# EasyEDA Pro project 4082驱动II.eprj

# Schematic 双机2.0
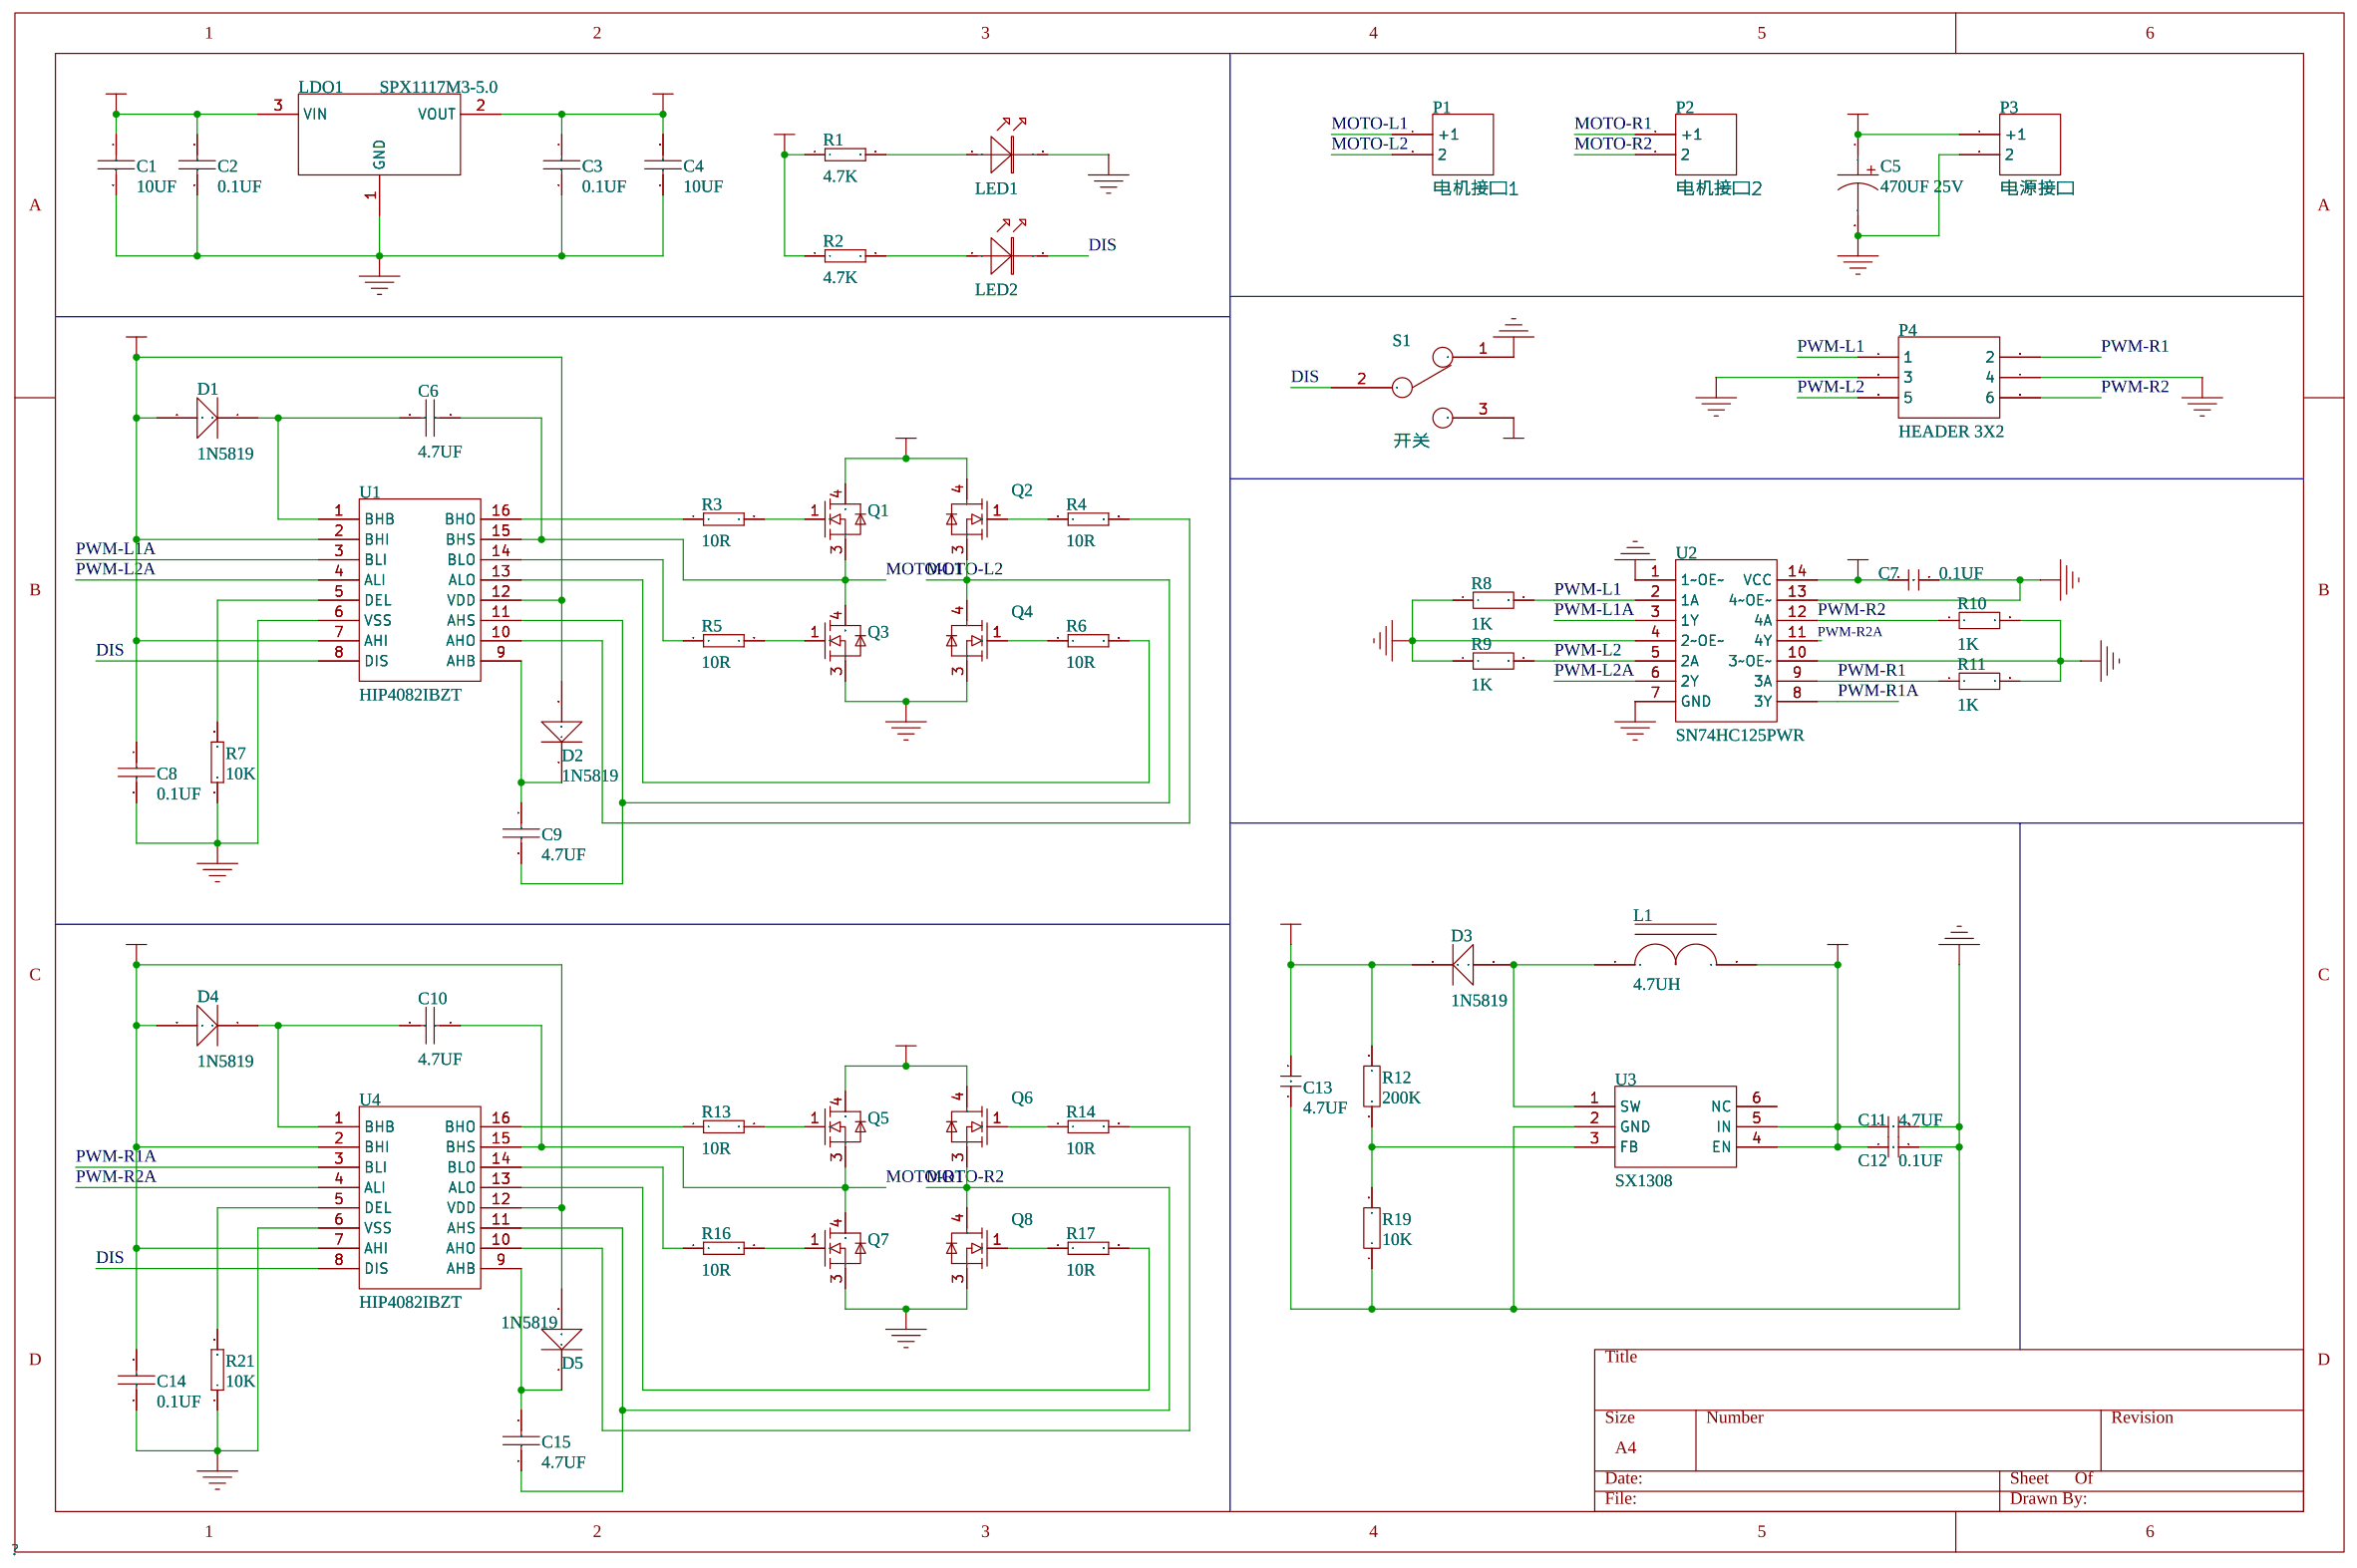
[diagram p0: schematic sheet]

## Parts
C1  10UF  [C 0603_L]
C2  0.1UF  [C 0603_L]
C3  0.1UF  [C 0603_L]
C4  10UF  [C 0603_L]
C5  470UF 25V  [CAP-TH_BD10.0-F5.00-D0.6-FD]
C6  4.7UF  [C 0603_L]
C7  0.1UF  [C 0603_L]
C8  0.1UF  [C 0603_L]
C9  4.7UF  [C 0603_L]
C10  4.7UF  [C 0603_L]
C11  4.7UF  [C 0603_L]
C12  0.1UF  [C 0603_L]
C13  4.7UF  [C 0603_L]
C14  0.1UF  [C 0603_L]
C15  4.7UF  [C 0603_L]
D1  1N5819  [SOD-123_L2.8-W1.8-LS3.7-RD]
D2  1N5819  [SOD-123_L2.8-W1.8-LS3.7-RD]
D3  1N5819  [SOD-123_L2.8-W1.8-LS3.7-RD]
D4  1N5819  [SOD-123_L2.8-W1.8-LS3.7-RD]
D5  1N5819  [SOD-123_L2.8-W1.8-LS3.7-RD]
L1  4.7UH  [CDRH74]
LDO1  SPX1117M3-5.0  [PCBComponent_1]
LED1  LED1  [LED0603-R-RD]
LED2  LED2  [LED0603-R-RD]
P1  电机接口1  [CONN-TH_XT30UPB-F]
P2  电机接口2  [CONN-TH_XT30UPB-F]
P3  电源接口  [CONN-TH_XT30UPB-F]
P4  HEADER 3X2  [HDR-TH_6P-P2.54-V-M-R2-C3-S2.54]
Q1  TPH1R403NL  [TO-252-2_L6.5-W6.1-P4.58-LS10.0-BR]
Q2  TPH1R403NL  [TO-252-2_L6.5-W6.1-P4.58-LS10.0-BR]
Q3  TPH1R403NL  [TO-252-2_L6.5-W6.1-P4.58-LS10.0-BR]
Q4  TPH1R403NL  [TO-252-2_L6.5-W6.1-P4.58-LS10.0-BR]
Q5  TPH1R403NL  [TO-252-2_L6.5-W6.1-P4.58-LS10.0-BR]
Q6  TPH1R403NL  [TO-252-2_L6.5-W6.1-P4.58-LS10.0-BR]
Q7  TPH1R403NL  [TO-252-2_L6.5-W6.1-P4.58-LS10.0-BR]
Q8  TPH1R403NL  [TO-252-2_L6.5-W6.1-P4.58-LS10.0-BR]
R1  4.7K  [R 0603_L]
R2  4.7K  [R 0603_L]
R3  10R  [R 0603_L]
R4  10R  [R 0603_L]
R5  10R  [R 0603_L]
R6  10R  [R 0603_L]
R7  10K  [R 0603_L]
R8  1K  [R 0603_L]
R9  1K  [R 0603_L]
R10  1K  [R 0603_L]
R11  1K  [R 0603_L]
R12  200K  [R 0603_L]
R13  10R  [R 0603_L]
R14  10R  [R 0603_L]
R16  10R  [R 0603_L]
R17  10R  [R 0603_L]
R19  10K  [R 0603_L]
R21  10K  [R 0603_L]
S1  开关  [SW-TH_SHOU-HAN_SS12D10G4]
U1  HIP4082IBZT  [SOIC-16_L9.9-W3.9-P1.27-LS6.0-BL]
U2  SN74HC125PWR  [TSSOP-14_L5.0-W4.4-P0.65-LS6.5-BL]
U3  SX1308  [SOT-23-6_L2.9-W1.6-P0.95-LS2.8-BR]
U4  HIP4082IBZT  [SOIC-16_L9.9-W3.9-P1.27-LS6.0-BL]

## Library data of the parts
C1 C4 = 10UF: Capacitor; Design Item ID: CAP; Library Name: ----20200314
C2 C3 C8 C14 = 0.1UF: Capacitor; Design Item ID: CAP; Library Name: ----20200314
C5 = 470UF 25V: Capacitor; Design Item ID: CAPACITOR POL; Library Name: ----20200314
C6 C9 C10 C15 = 4.7UF: Capacitor; Design Item ID: CAP; Library Name: ----20200314
C7 C12 = 0.1UF: -޼-----Ƭ----; BOM____: 无极性贴片电容; __Ȩ____: 源创客; ѧϰ__Դ: www.ooocke.com; ____: X7R; Design Item ID: C; Library Name: 3.1   - -------------
C11 C13 = 4.7UF: -޼-----Ƭ----; BOM____: 无极性贴片电容; __Ȩ____: 源创客; ѧϰ__Դ: www.ooocke.com; ____: X7R; Design Item ID: C; Library Name: 3.1   - -------------
D1 D2 D4 D5 = 1N5819: Library Name: Schlib3
D3 = 1N5819: Library Name: double qudong
L1 = 4.7UH: Design Item ID: INDUCTOR 2; Library Name: double qudong
LDO1 = SPX1117M3-5.0: Library Name: Schlib1
LED1 = LED1: Design Item ID: LED; Library Name: ----20200314
LED2 = LED2: Design Item ID: LED; Library Name: ----20200314
P1 = 电机接口1: Design Item ID: ----ӿ-; Library Name: Schlib1
P2 = 电机接口2: Design Item ID: ----ӿ-; Library Name: Schlib1
P3 = 电源接口: Design Item ID: ----ӿ-; Library Name: Schlib1
P4 = HEADER 3X2: Library Name: ----20200314
Q1 Q3 Q5 Q7 = TPH1R403NL: Design Item ID: TPH1R403NL_1; Library Name: DRV8701E
Q2 Q4 Q6 Q8 = TPH1R403NL: Library Name: DRV8701E
R1 R2 = 4.7K: Design Item ID: RES2; Library Name: ----20200314
R3-R6 R13 R14 R16 R17 = 10R: Design Item ID: RES2; Library Name: ----20200314
R7 R21 = 10K: Design Item ID: RES2; Library Name: ----20200314
R8-R11 = 1K: --Ƭ----; BOM____: 贴片电阻; ѧϰ__Դ: www.ooocke.com; __Ȩ____: 源创客; Design Item ID: R; Library Name: 3.1   - -------------
R12 = 200K: --Ƭ----; BOM____: 贴片电阻; ѧϰ__Դ: www.ooocke.com; __Ȩ____: 源创客; Design Item ID: R; Library Name: 3.1   - -------------
R19 = 10K: --Ƭ----; BOM____: 贴片电阻; ѧϰ__Դ: www.ooocke.com; __Ȩ____: 源创客; Design Item ID: R; Library Name: 3.1   - -------------
S1 = 开关: Design Item ID: ----; Library Name: DRV8701E
U1 U4 = HIP4082IBZT: Library Name: Schlib1
U2 = SN74HC125PWR: --̬-------·------ TSSOP-20; Library Name: -------ԭ--ͼ--
U3 = SX1308: sot-23-6С--ѹDC-DC; Library Name: -------ԭ--ͼ--

## Nets
5V: C3.1 C4.1 C7.1 C11.1 C12.1 L1.2 LDO1.2(VOUT) R1.1 R2.1 S1.3 U2.14(VCC) U3.4(EN) U3.5(IN)
12V: C8.1 C13.2 C14.1 D1.2 D2.2 D3.1 D4.2 D5.2 R12.2 U1.2(BHI) U1.7(AHI) U1.12(VDD) U4.2(BHI) U4.7(AHI) U4.12(VDD)
GND: C1.2 C2.2 C3.2 C4.2 C5.2 C7.2 C8.2 C11.2 C12.2 C13.1 C14.2 LDO1.1(GND) LED1.2 P3.2 P4.3 P4.4 Q3.3(S) Q4.3(S) Q7.3(S) Q8.3(S) R7.1 R8.1 R9.1 R10.2 R11.2 R19.1 R21.1 S1.1 U1.6(VSS) U2.1(1~OE~) U2.4(2~OE~) U2.7(GND) U2.10(3~OE~) U2.13(4~OE~) U3.2(GND) U4.6(VSS)
VCC: C1.1 C2.1 C5.1 LDO1.3(VIN) P3.1(+1) Q1.4(D) Q2.4(D) Q5.4(D) Q6.4(D)
DIS: LED2.2 S1.2 U1.8(DIS) U4.8(DIS)
MOTO-L1: C6.2 P1.1(+1) Q1.3(S) Q3.4(D) U1.15(BHS)
MOTO-L2: C9.2 P1.2 Q2.3(S) Q4.4(D) U1.11(AHS)
MOTO-R1: C10.2 P2.1(+1) Q5.3(S) Q7.4(D) U4.15(BHS)
MOTO-R2: C15.2 P2.2 Q6.3(S) Q8.4(D) U4.11(AHS)
PWM-L1: P4.1 R8.2 U2.2(1A)
PWM-L1A: U1.3(BLI) U2.3(1Y)
PWM-L2: P4.5 R9.2 U2.5(2A)
PWM-L2A: U1.4(ALI) U2.6(2Y)
PWM-R1: P4.2 R11.1 U2.9(3A)
PWM-R1A: U2.8(3Y) U4.3(BLI)
PWM-R2: P4.6 R10.1 U2.12(4A)
PWM-R2A: U2.11(4Y) U4.4(ALI)
NETC6_1: C6.1 D1.1 U1.1(BHB)
NETC9_1: C9.1 D2.1 U1.9(AHB)
NETC10_1: C10.1 D4.1 U4.1(BHB)
NETC15_1: C15.1 D5.1 U4.9(AHB)
NETD3_2: D3.2 L1.1 U3.1(SW)
NETLED1_1: LED1.1 R1.2
NETLED2_1: LED2.1 R2.2
NETQ1_1: Q1.1(G) R3.2
NETQ2_1: Q2.1(G) R4.1
NETQ3_1: Q3.1(G) R5.2
NETQ4_1: Q4.1(G) R6.1
NETQ5_1: Q5.1(G) R13.2
NETQ6_1: Q6.1(G) R14.1
NETQ7_1: Q7.1(G) R16.2
NETQ8_1: Q8.1(G) R17.1
NETR3_1: R3.1 U1.16(BHO)
NETR4_2: R4.2 U1.10(AHO)
NETR5_1: R5.1 U1.14(BLO)
NETR6_2: R6.2 U1.13(ALO)
NETR7_2: R7.2 U1.5(DEL)
NETR12_1: R12.1 R19.2 U3.3(FB)
NETR13_1: R13.1 U4.16(BHO)
NETR14_2: R14.2 U4.10(AHO)
NETR16_1: R16.1 U4.14(BLO)
NETR17_2: R17.2 U4.13(ALO)
NETR21_2: R21.2 U4.5(DEL)

Not connected (* = marked no-connect by the designer): U3 6(NC)

# Board 双机3.0
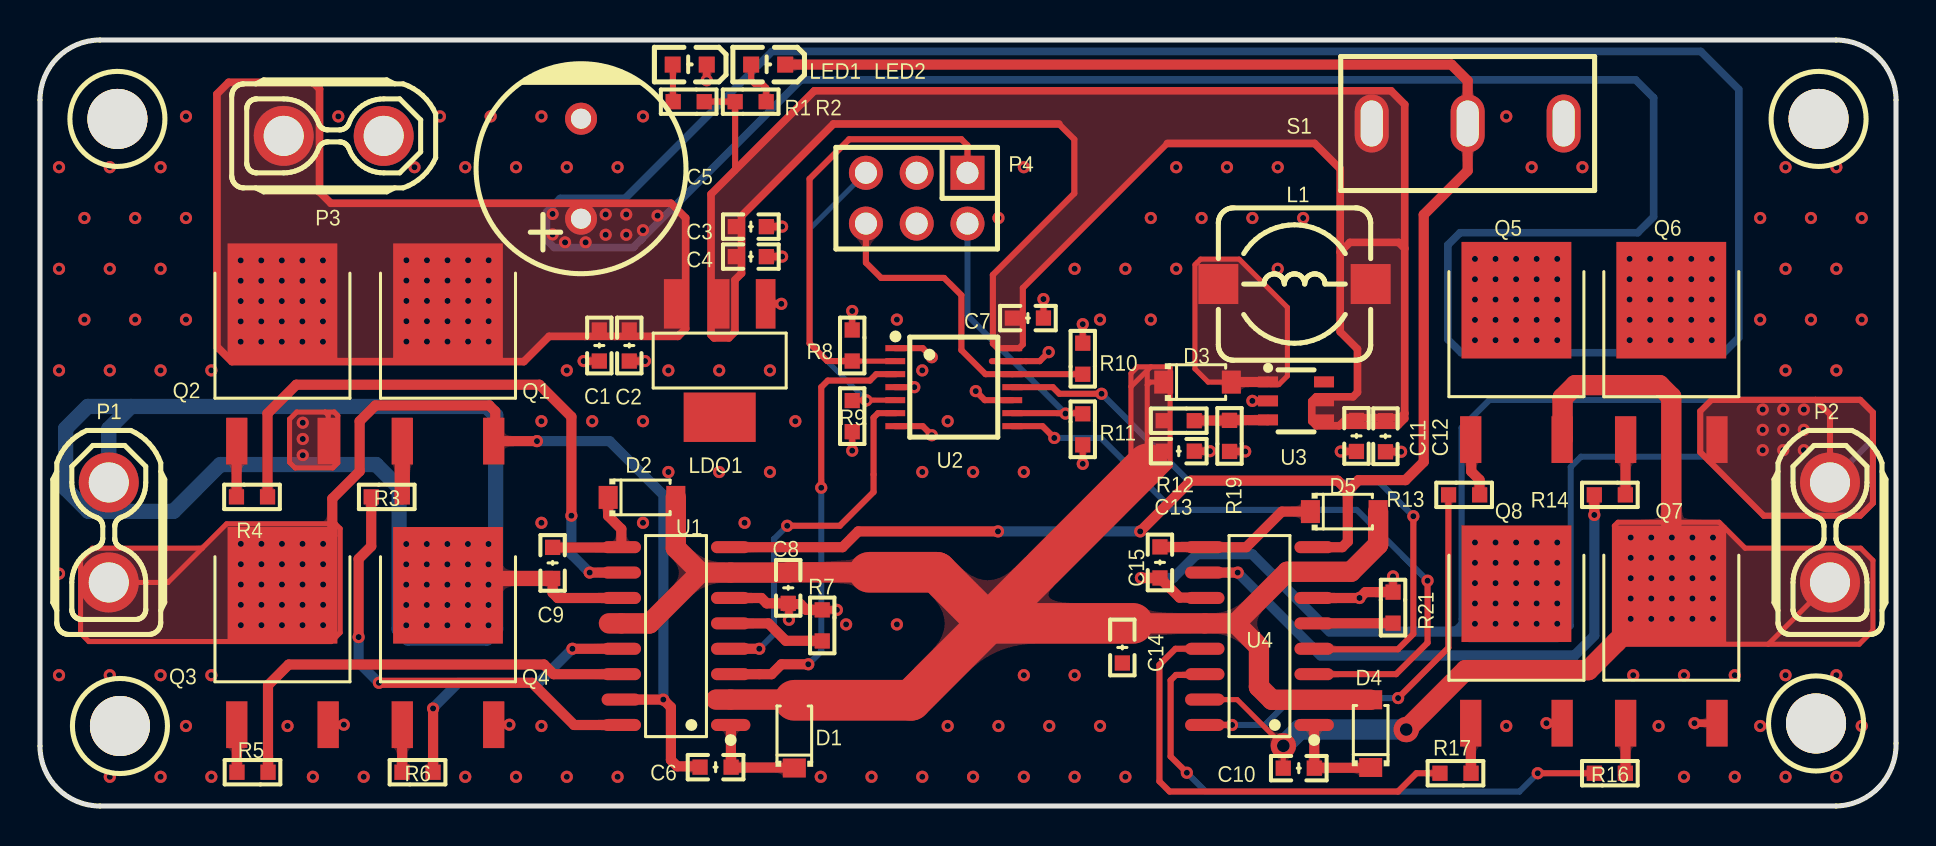
[diagram p1: board, top side]
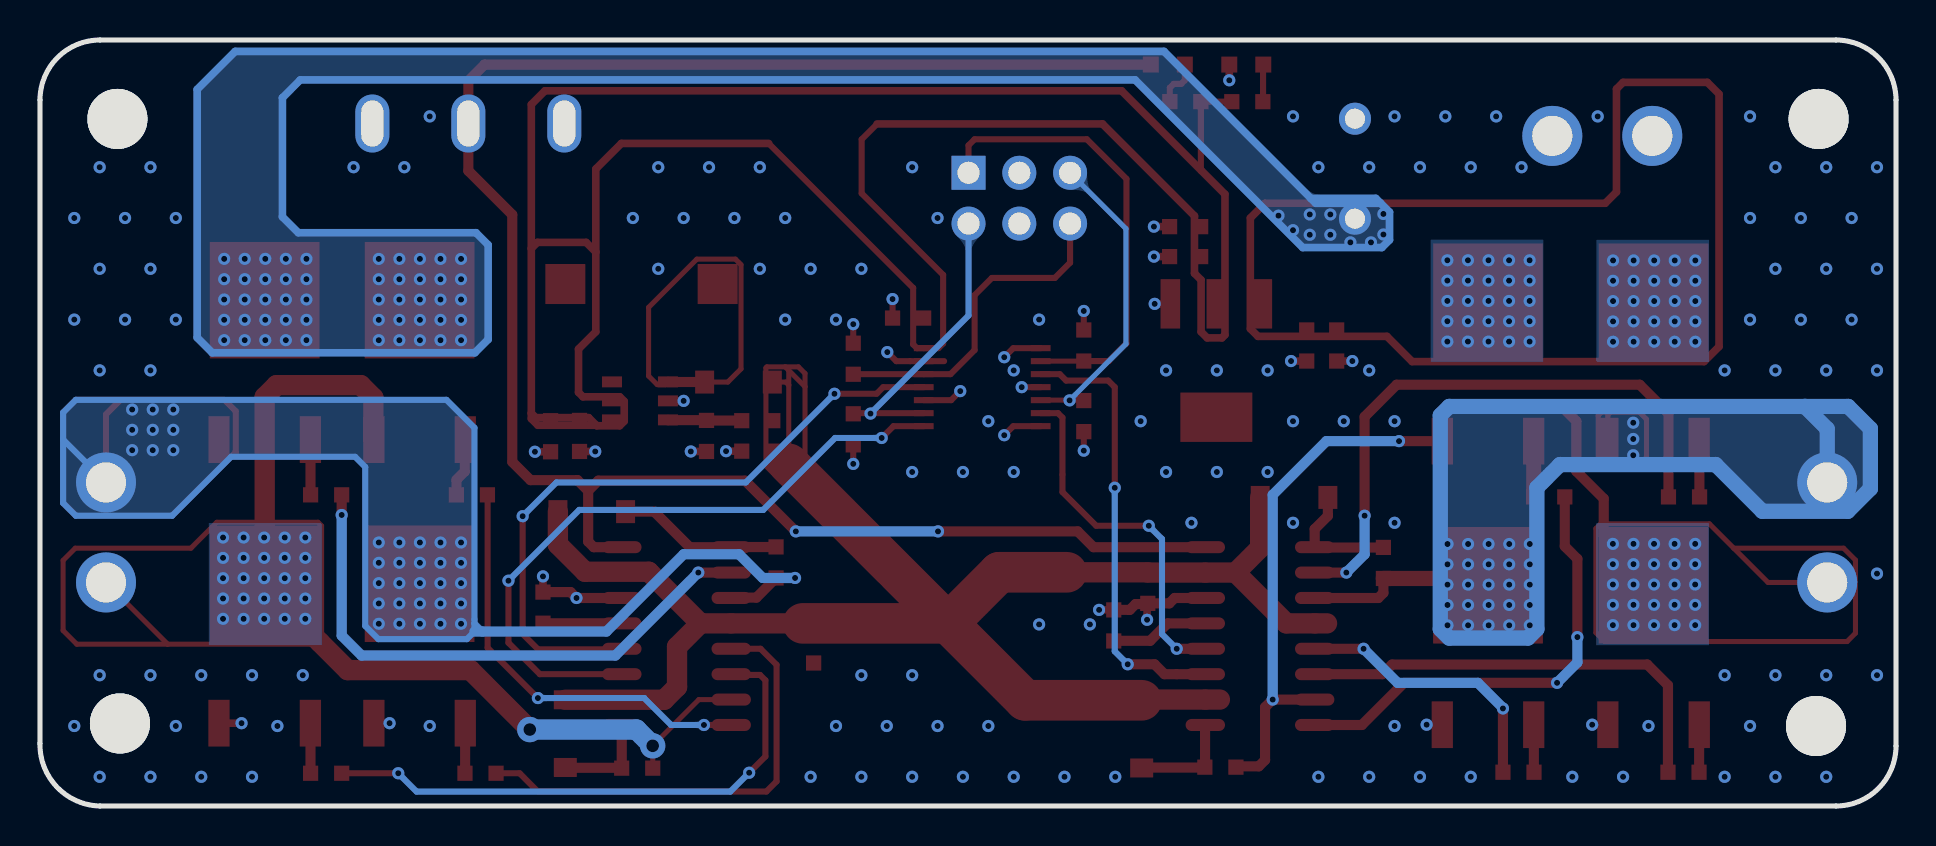
[diagram p2: board, bottom side, seen from below]

Outline 92.84 x 38.3 mm; copper layers: Top Layer, Bottom Layer. Coordinates in mm from the lower left corner of the outline.
Outline path: 0,35.3 0,3 arc(0.88,0.88) 3,0 89.84,0 arc(91.98,0.94) 92.84,3.13 92.84,35.3 arc(91.96,37.42) 89.84,38.3 3,38.3 arc(0.88,37.42) 0,35.3
Stack: Top Layer 0.0356mm / Dielectric 1 0.32mm FR-4 er 4.8 / Bottom Layer 0.0356mm

## Design rules (mm)
spacing Clearance (default): track to track 0.254, other pairs 0 to 0.381
track width PWR (default): min 0.254, default 0.508, max 2.032
track width Width: min 0.254, default 0.381, max 0.508
differential pair DiffPairsRouting (default): width min 0.381, default 0.381, max 0.381; gap min 0.254, default 0.254
via viaSize (default): diameter min 0.5, default 0.61, max 10; hole min 0.3, default 0.305, max 6

## Placement (name value [footprint] x y rotation side)
C1  10UF  [C 0603_L]  27.98 23.02 270 top
C2  0.1UF  [C 0603_L]  29.48 23.02 270 top
C3  0.1UF  [C 0603_L]  35.56 28.97 0 top
C4  10UF  [C 0603_L]  35.56 27.47 0 top
C5  470UF 25V  [CAP-TH_BD10.0-F5.00-D0.6-FD]  27.06 31.86 90 top
C6  4.7UF  [C 0603_L]  33.79 1.94 180 top
C7  0.1UF  [C 0603_L]  49.41 24.4 0 top
C8  0.1UF  [C 0603_L]  37.43 10.91 270 top
C9  4.7UF  [C 0603_L]  25.64 12.15 270 top
C10  4.7UF  [C 0603_L]  62.96 1.89 180 top
C11  4.7UF  [C 0603_L]  65.85 18.5 270 top
C12  0.1UF  [C 0603_L]  67.3 18.49 270 top
C13  4.7UF  [C 0603_L]  56.96 17.74 180 top
C14  0.1UF  [C 0603_L]  54.14 7.93 270 top
C15  4.7UF  [C 0603_L]  56.02 12.18 270 top
D1  1N5819  [SOD-123_L2.8-W1.8-LS3.7-RD]  37.73 3.59 90 top
D2  1N5819  [SOD-123_L2.8-W1.8-LS3.7-RD]  30.11 15.43 0 top
D3  1N5819  [SOD-123_L2.8-W1.8-LS3.7-RD]  57.9 21.2 0 top
D4  1N5819  [SOD-123_L2.8-W1.8-LS3.7-RD]  66.56 3.62 90 top
D5  1N5819  [SOD-123_L2.8-W1.8-LS3.7-RD]  65.24 14.72 0 top
L1  4.7UH  [CDRH74]  62.75 26.1 0 top
LDO1  SPX1117M3-5.0  [PCBComponent_1]  33.86 26.39 90 top
LED1  LED1  [LED0603-R-RD]  32.5 37.07 180 top
LED2  LED2  [LED0603-R-RD]  36.42 37.07 180 top
NOREF  -  [Pad_ie6]  88.96 34.35 180 top
NOREF#2  -  [Pad_ie5]  88.84 4.13 90 top
NOREF#3  -  [Pad_ie4]  4 4 0 top
NOREF#4  -  [Pad_ie3]  3.87 34.35 270 top
P1  电机接口1  [CONN-TH_XT30UPB-F]  3.44 13.68 90 top
P2  电机接口2  [CONN-TH_XT30UPB-F]  89.53 13.68 90 top
P3  电源接口  [CONN-TH_XT30UPB-F]  14.69 33.51 0 top
P4  HEADER 3X2  [HDR-TH_6P-P2.54-V-M-R2-C3-S2.54]  43.85 30.39 180 top
Q1  TPH1R403NL  [TO-252-2_L6.5-W6.1-P4.58-LS10.0-BR]  20.41 21.73 270 top
Q2  TPH1R403NL  [TO-252-2_L6.5-W6.1-P4.58-LS10.0-BR]  12.13 21.73 270 top
Q3  TPH1R403NL  [TO-252-2_L6.5-W6.1-P4.58-LS10.0-BR]  12.13 7.55 270 top
Q4  TPH1R403NL  [TO-252-2_L6.5-W6.1-P4.58-LS10.0-BR]  20.41 7.55 270 top
Q5  TPH1R403NL  [TO-252-2_L6.5-W6.1-P4.58-LS10.0-BR]  73.85 21.81 270 top
Q6  TPH1R403NL  [TO-252-2_L6.5-W6.1-P4.58-LS10.0-BR]  81.6 21.81 270 top
Q7  TPH1R403NL  [TO-252-2_L6.5-W6.1-P4.58-LS10.0-BR]  81.6 7.63 270 top
Q8  TPH1R403NL  [TO-252-2_L6.5-W6.1-P4.58-LS10.0-BR]  73.85 7.63 270 top
R1  4.7K  [R 0603_L]  32.45 35.22 180 top
R2  4.7K  [R 0603_L]  35.55 35.22 0 top
R3  10R  [R 0603_L]  17.35 15.46 0 top
R4  10R  [R 0603_L]  10.6 15.46 0 top
R5  10R  [R 0603_L]  10.63 1.69 180 top
R6  10R  [R 0603_L]  18.88 1.69 0 top
R7  10K  [R 0603_L]  39.13 9.03 270 top
R8  1K  [R 0603_L]  40.63 23.02 270 top
R9  1K  [R 0603_L]  40.63 19.49 90 top
R10  1K  [R 0603_L]  52.16 22.36 90 top
R11  1K  [R 0603_L]  52.16 18.83 270 top
R12  200K  [R 0603_L]  56.96 19.27 180 top
R13  10R  [R 0603_L]  71.23 15.56 0 top
R14  10R  [R 0603_L]  78.52 15.56 180 top
R16  10R  [R 0603_L]  78.52 1.64 0 top
R17  10R  [R 0603_L]  70.8 1.64 180 top
R19  10K  [R 0603_L]  59.5 18.5 90 top
R21  10K  [R 0603_L]  67.68 9.92 270 top
S1  开关  [SW-TH_SHOU-HAN_SS12D10G4]  71.41 34.12 180 top
U1  HIP4082IBZT  [SOIC-16_L9.9-W3.9-P1.27-LS6.0-BL]  31.81 8.5 90 top
U2  SN74HC125PWR  [TSSOP-14_L5.0-W4.4-P0.65-LS6.5-BL]  45.71 20.94 270 top
U3  SX1308  [SOT-23-6_L2.9-W1.6-P0.95-LS2.8-BR]  62.83 20.26 180 top
U4  HIP4082IBZT  [SOIC-16_L9.9-W3.9-P1.27-LS6.0-BL]  61 8.5 90 top

## Footprints (pads in the part's own frame, mm; a bottom-side part is the same pattern mirrored in y, then rotated)
C 0603_L
  rect 0.762x0.762 smd: 1(-0.777,0) 2(0.777,0)
CAP-TH_BD10.0-F5.00-D0.6-FD
  round 1.6 hole 1: 1(-2.5,0) 2(2.5,0)
CDRH74
  rect 2x2 smd: 1(-3.81,0) 2(3.81,0)
CONN-TH_XT30UPB-F
  round 3 hole 2: 1(-2.5,0) 2(2.5,0)
HDR-TH_6P-P2.54-V-M-R2-C3-S2.54
  rect 1.7x1.7 hole 1.1: 1(-2.54,-1.27)
  round 1.7 hole 1.1: 2(-2.54,1.27) 3(0,-1.27) 4(0,1.27) 5(2.54,-1.27) 6(2.54,1.27)
LED0603-R-RD
  rect 0.8x0.8 smd: 1(0.851,0) 2(-0.851,0)
Pad_ie3
  round 3 hole 3: 1(0,0)
Pad_ie4
  round 3 hole 3: 1(0,0)
Pad_ie5
  round 3 hole 3: 1(0,0)
Pad_ie6
  round 3 hole 3: 1(0,0)
PCBComponent_1
  rect 2.47x0.98 smd: 1(-1.286,-2.438) 2(-1.286,-0.138) 3(-1.286,2.163)
  rect 2.47x3.6 smd: 2(-6.955,-0.138)
R 0603_L
  rect 0.762x0.762 smd: 1(-0.777,0) 2(0.777,0)
SOD-123_L2.8-W1.8-LS3.7-RD
  rect 0.95x1.15 smd: 1(-1.692,0) 2(1.692,0)
SOIC-16_L9.9-W3.9-P1.27-LS6.0-BL
  oval 0.602x1.971 smd: 1(-4.445,-2.736) 2(-3.175,-2.736) 3(-1.905,-2.736) 4(-0.635,-2.736) 5(0.635,-2.736) 6(1.905,-2.736) 7(3.175,-2.736) 8(4.445,-2.736) 9(4.445,2.736) 10(3.175,2.736) 11(1.905,2.736) 12(0.635,2.736) 13(-0.635,2.736) 14(-1.905,2.736) 15(-3.175,2.736) 16(-4.445,2.736)
SOT-23-6_L2.9-W1.6-P0.95-LS2.8-BR
  rect 1x0.55 smd: 1(1.4,-0.95) 2(1.4,0) 3(1.4,0.95) 4(-1.4,0.95) 5(-1.4,0) 6(-1.4,-0.95)
SW-TH_SHOU-HAN_SS12D10G4
  oval 1.7x2.9 hole 1.1x2.3: 1(-4.8,0) 2(0,0) 3(4.8,0)
TO-252-2_L6.5-W6.1-P4.58-LS10.0-BR
  rect 2.336x1.064 smd: 1(3.486,-2.286) 3(3.486,2.286)
  rect 5.826x5.491 smd: 4(-3.486,0)
TSSOP-14_L5.0-W4.4-P0.65-LS6.5-BL
  rect 0.305x0.991 smd: 1(-1.95,-2.925) 2(-1.3,-2.925) 3(-0.65,-2.925) 4(0,-2.925) 5(0.65,-2.925) 6(1.3,-2.925) 7(1.95,-2.925) 8(1.95,2.925) 9(1.3,2.925) 10(0.65,2.925) 11(0,2.925) 12(-0.65,2.925) 13(-1.3,2.925) 14(-1.95,2.925)

## Nets
As in the schematic.

Pads without a net: NOREF 1; NOREF#2 1; NOREF#3 1; NOREF#4 1; U3 6

## Via types
v1: diameter 0.61, hole 0.305, Top Layer to Bottom Layer, 400 vias
v2: diameter 1.27, hole 0.635, Top Layer to Bottom Layer, 2 vias

## Routing (per net, layer and track width the routed paths; a pad name or vN(x,y) marks a point on that pad's centre or on a via; arc(x,y) is an arc through that point)
5V: length 153.7
  Top Layer w0.305: R1.1 R2.1 34.77,31.8 34.72,31.75 ; 56.39,33.13 49.16,25.9 49.16,23.08 48.97,22.89 U2.14 47.9,22.89 47.66,23.13 47.66,26.56 51.74,30.63 51.74,33.33 50.97,34.1
  Top Layer w0.381: 34.77,31.8 38.74,35.76 67.58,35.76 68.26,35.08 68.26,27.88 ; 65.04,27.7 65.04,31.85 63.76,33.13 56.39,33.13 ; 65.04,27.7 65.04,23.71 65.9,22.85 65.9,20.68 65.68,20.46 63.84,20.46 63.61,20.24 63.61,19.24 63.84,19.01 64.99,19.01 65.01,19.04 ; 65.04,27.7 65.52,28.18 67.96,28.18 68.26,27.88 ; 68.26,19.64 68.26,19.37 67.93,19.04 65.01,19.04 ; 68.26,19.64 68.26,27.88 ; 68.26,19.64 68.04,19.42 65.39,19.42 65.01,19.04 ; 34.72,31.75 33.57,30.59 33.57,23.56 33.72,23.41 34.45,23.41 34.76,23.71 34.76,26.3 35.09,26.63 35.09,29.5 39.69,34.1 50.97,34.1 ; C7.1 48.64,24.4
12V: length 103.9
  Top Layer w0.254: 54.57,17.11 54.57,20.97 ; 54.57,20.97 54.57,21.63 54.9,21.96 55.56,21.96 ; 54.57,20.97 55.38,21.78 ; 55.38,21.78 55.38,21.05 ; 55.38,21.78 55.56,21.96 ; D3.1 55.53,21.2 55.38,21.05 ; 55.56,21.96 56.48,21.96 56.53,21.91 56.53,17 55.74,16.22 ; 55.38,21.05 55.38,17.08 55.45,17.01 55.51,16.95
  Top Layer w0.508: 56.17,19.28 R12.2
  Top Layer w1.016: 33.03,11.67 37.43,11.67 ; 33.03,11.67 31.8,12.9 D2.2 ; 33.03,11.67 30.49,9.13 U1.12 28.46,9.13 ; C8.1 41.48,11.69 ; 59.8,9.13 60.97,7.96 60.97,5.96 61.62,5.31 D4.2 ; 59.8,9.13 62.38,11.71 65.57,11.71 66.93,13.07 D5.2 ; 59.8,9.13 U4.12 54.67,9.13 ; 37.73,5.32 U1.2 33.82,5.32 ; 49.96,11.69 50.18,11.9
  Top Layer w2.032: 41.48,11.69 44.85,11.69 47.41,9.13 ; 47.41,9.13 43.56,5.29 D1.2 ; 47.41,9.13 49.96,11.69 ; 47.41,9.13 54.67,9.13 ; 50.18,11.9 55.38,17.11
GND: length 38.1
  Top Layer w0.305: R10.2 v1(52.16,24.09) ; v1(44.61,22.44) 44.15,22.89 U2.1 ; U2.7 44.15,18.99 v1(44.61,18.54) ; C7.2 v1(50.19,25.35) ; R8.1 v1(40.63,24.75) ; v1(40.63,17.77) R9.1 ; U2.10 47.26,20.29 v1(46.81,20.74) ; v1(52.16,17.11) R11.2 ; U2.4 v1(43.73,20.94) ; 47.61,22.24 U2.13 50,22.24 v1(50.46,22.69)
  Top Layer w0.381: v1(37.46,9.31) 37.46,10.1 ; C4.2 v1(37.12,27.47) ; C12.2 v1(68.08,17.71) ; v1(75.35,4.14) Q8.3 ; v1(82.75,4.14) Q7.3 ; v1(60.64,20.26) U3.2 ; v1(33.35,36.29) 33.35,37.07 ; R19.1 v1(60.28,17.73) ; Q4.3 v1(23.48,4.06) ; v1(65.06,17.73) C11.2 ; C2.2 v1(30.26,22.25) ; 36.3,25.11 v1(37.08,25.11) ; 39.08,9.81 v1(39.86,9.81) ; R21.1 v1(67.68,11.48) ; Q3.3 v1(15.2,4.06) ; C13.1 v1(58.52,17.74) ; C3.2 v1(37.12,28.97) ; v1(27.19,22.25) C1.2
  Top Layer w0.508: R7.1 38.33,9.81 38.04,10.1 37.46,10.1 C8.2 36.35,10.13 36.08,10.4 U1.6 ; R21.1 66.3,10.69 v1(66,10.4) U4.6
  vias: v1(0.95,31.94) v1(0.95,26.86) v1(0.95,21.78) v1(0.95,11.62) v1(0.95,6.54) v1(2.22,29.4) v1(2.22,24.32) v1(3.49,31.94) v1(3.49,26.86) v1(3.49,21.78) v1(3.49,6.54) v1(3.49,1.46) v1(4.76,29.4) v1(4.76,24.32) v1(6.03,31.94) v1(6.03,26.86) v1(6.03,21.78) v1(6.03,6.54) v1(6.03,1.46) v1(7.3,34.48) v1(7.3,29.4) v1(7.3,24.32) v1(7.3,4) v1(8.57,21.78) v1(8.57,6.54) v1(8.57,1.46) v1(12.38,4) v1(13.65,1.46) v1(14.92,34.48) v1(16.19,1.46) v1(18.73,31.94) v1(20,34.48) v1(21.27,31.94) v1(21.27,1.46) v1(22.54,34.48) v1(23.81,31.94) v1(23.81,1.46) v1(25.08,34.48) v1(25.08,19.24) v1(25.08,14.16) v1(25.08,4) v1(26.35,31.94) v1(26.35,21.78) v1(26.35,1.46) v1(27.62,19.24) v1(28.89,31.94) v1(28.89,1.46) v1(30.16,34.48) v1(30.16,19.24) v1(30.16,14.16) v1(31.43,21.78) v1(31.43,16.7) v1(33.97,21.78) v1(33.97,16.7) v1(35.24,14.16) v1(36.51,21.78) v1(36.51,16.7) v1(37.78,19.24) v1(39.05,1.46) v1(40.32,9.08) v1(41.59,1.46) v1(42.86,24.32) v1(42.86,9.08) v1(44.13,21.78) v1(44.13,16.7) v1(44.13,1.46) v1(45.4,19.24) v1(45.4,4) v1(46.67,16.7) v1(46.67,1.46) v1(47.94,29.4) v1(47.94,4) v1(49.21,31.94) v1(49.21,16.7) v1(49.21,6.54) v1(49.21,1.46) v1(50.48,4) v1(51.75,26.86) v1(51.75,6.54) v1(51.75,1.46) v1(53.02,24.32) v1(53.02,4) v1(54.29,26.86) v1(54.29,1.46) v1(55.56,29.4) v1(55.56,24.32) v1(56.83,31.94) v1(56.83,26.86) v1(58.1,29.4) v1(59.37,31.94) v1(60.64,29.4) v1(61.91,31.94) v1(61.91,26.86) v1(63.18,29.4) v1(73.34,34.48) v1(73.34,4) v1(74.61,31.94) v1(77.15,31.94) v1(79.69,6.54) v1(80.96,4) v1(82.23,6.54) v1(82.23,1.46) v1(84.77,6.54) v1(84.77,1.46) v1(86.04,29.4) v1(86.04,24.32) v1(86.04,4) v1(87.31,31.94) v1(87.31,26.86) v1(87.31,21.78) v1(87.31,6.54) v1(87.31,1.46) v1(88.58,29.4) v1(88.58,24.32) v1(89.85,31.94) v1(89.85,26.86) v1(89.85,21.78) v1(89.85,6.54) v1(89.85,1.46) v1(91.12,29.4) v1(91.12,24.32) v1(91.12,4)
VCC: length 249.3
  Top Layer w0.381: 8.85,35.6 9.44,36.18 13.65,36.18 13.98,35.85 13.98,30.7 14.55,30.14 31.56,30.14 32.3,29.4 32.3,23.86 31.91,23.48 25.46,23.48 24.2,22.22 9.6,22.22 8.85,22.97 8.85,35.6
  Bottom Layer w0.381: 25.78,30.14 29.02,30.14 29.27,30.38 ; 25.78,30.14 26.02,30.38 29.27,30.38 ; 25.78,30.14 25.34,29.69 25.34,28.3 25.72,27.92 29.68,27.92 38.06,36.31 79.82,36.31 80.71,35.41 80.71,29.46 79.92,28.66 71.03,28.66 70.42,28.05 70.42,23.33 71.09,22.66 84.22,22.66 84.97,23.42 84.97,35.83 83.07,37.73 36.62,37.73 29.27,30.38
  vias: v1(10.04,27.28) v1(10.04,26.26) v1(10.04,25.25) v1(10.04,24.23) v1(10.04,23.21) v1(11.07,27.28) v1(11.07,26.26) v1(11.07,25.25) v1(11.07,24.23) v1(11.07,23.21) v1(12.1,27.28) v1(12.1,26.26) v1(12.1,25.25) v1(12.1,24.23) v1(12.1,23.21) v1(13.12,27.28) v1(13.12,26.26) v1(13.12,25.25) v1(13.12,24.23) v1(13.12,23.21) v1(14.15,27.28) v1(14.15,26.26) v1(14.15,25.25) v1(14.15,24.23) v1(14.15,23.21) v1(18.33,27.29) v1(18.33,26.27) v1(18.33,25.25) v1(18.33,24.24) v1(18.33,23.22) v1(19.36,27.29) v1(19.36,26.27) v1(19.36,25.25) v1(19.36,24.24) v1(19.36,23.22) v1(20.38,27.29) v1(20.38,26.27) v1(20.38,25.25) v1(20.38,24.24) v1(20.38,23.22) v1(21.41,27.29) v1(21.41,26.27) v1(21.41,25.25) v1(21.41,24.24) v1(21.41,23.22) v1(22.44,27.29) v1(22.44,26.27) v1(22.44,25.25) v1(22.44,24.24) v1(22.44,23.22) v1(25.64,29.6) v1(25.64,28.57) v1(26.26,28.18) v1(27.29,28.18) v1(28.29,29.58) v1(28.29,28.56) v1(29.32,29.58) v1(29.32,28.56) v1(30.16,28.79) v1(30.89,29.52) v1(71.78,27.35) v1(71.78,26.34) v1(71.78,25.32) v1(71.78,24.31) v1(71.78,23.29) v1(72.81,27.35) v1(72.81,26.34) v1(72.81,25.32) v1(72.81,24.31) v1(72.81,23.29) v1(73.83,27.35) v1(73.83,26.34) v1(73.83,25.32) v1(73.83,24.31) v1(73.83,23.29) v1(74.86,27.35) v1(74.86,26.34) v1(74.86,25.32) v1(74.86,24.31) v1(74.86,23.29) v1(75.89,27.35) v1(75.89,26.34) v1(75.89,25.32) v1(75.89,24.31) v1(75.89,23.29) v1(79.51,27.36) v1(79.51,26.34) v1(79.51,25.33) v1(79.51,24.31) v1(79.51,23.29) v1(80.54,27.36) v1(80.54,26.34) v1(80.54,25.33) v1(80.54,24.31) v1(80.54,23.29) v1(81.57,27.36) v1(81.57,26.34) v1(81.57,25.33) v1(81.57,24.31) v1(81.57,23.29) v1(82.6,27.36) v1(82.6,26.34) v1(82.6,25.33) v1(82.6,24.31) v1(82.6,23.29) v1(83.62,27.36) v1(83.62,26.34) v1(83.62,25.33) v1(83.62,24.31) v1(83.62,23.29)
DIS: length 95.6
  Top Layer w0.508: v1(55.03,13.73) 57.57,16.27 64.91,16.27 65.42,15.76 ; 65.42,15.76 65.95,16.29 68.3,16.29 69.21,17.21 69.21,29.56 71.41,31.76 S1.2 71.41,36.26 70.6,37.07 LED2.2 ; 65.42,15.76 65.42,13.22 65.14,12.94 U4.8 ; U1.8 40.14,12.94 40.93,13.73 v1(47.92,13.73)
  Bottom Layer w0.508: v1(47.92,13.73) v1(55.03,13.73)
MOTO-L1: length 86.7
  Top Layer w0.254: 8.11,12.89 9.33,14.11 14.77,14.11 15.01,13.87 15.01,8.67 14.57,8.22 2.45,8.22 2.03,8.64 2.03,12.3 2.62,12.89 8.11,12.89 ; 8.11,12.89 6.4,11.18 P1.1
  Top Layer w0.508: v1(24.86,18.24) Q1.3 22.77,18.32 22.77,19.73 22.47,20.03 16.78,20.03 15.99,19.24 15.99,16.74 14.62,15.37 14.62,13.53 14.18,13.09 13.16,12.07 Q3.4 ; U1.15 v1(31.18,5.32) 31.56,4.94 31.56,2.3 31.87,1.98 32.98,1.98 33.02,1.94
  Bottom Layer w0.508: v1(31.18,5.32) 31.18,15.56 28.49,18.24 v1(24.86,18.24)
  vias: v1(10.05,13.11) v1(10.05,12.09) v1(10.05,11.08) v1(10.05,10.06) v1(10.05,9.04) v1(11.08,13.11) v1(11.08,12.09) v1(11.08,11.08) v1(11.08,10.06) v1(11.08,9.04) v1(12.1,13.11) v1(12.1,12.09) v1(12.1,11.08) v1(12.1,10.06) v1(12.1,9.04) v1(13.13,13.11) v1(13.13,12.09) v1(13.13,11.08) v1(13.13,10.06) v1(13.13,9.04) v1(14.16,13.11) v1(14.16,12.09) v1(14.16,11.08) v1(14.16,10.06) v1(14.16,9.04)
MOTO-L2: length 92.2
  Top Layer w0.254: 14.27,19.7 14.41,19.55 Q2.3 ; 14.27,19.7 12.84,19.7 12.48,19.34 12.48,17.18 12.76,16.9 14.64,16.9 14.9,17.16 14.9,19.52 14.72,19.7 14.27,19.7
  Top Layer w0.508: C9.2 25.64,10.66 25.9,10.4 U1.11
  Top Layer w0.762: 14.49,18.32 Q2.3 14.31,18.35 ; C9.2 20.75,11.38 Q4.4
  Bottom Layer w0.762: 4.56,19.98 3.44,18.86 P1.2 ; 4.56,19.98 22.35,19.98 22.79,19.53 22.79,8.84 22.35,8.4 18.41,8.4 17.97,8.84 17.97,15.92 16.81,17.07 9.02,17.07 6.68,14.74 2.41,14.74 1.28,15.87 1.28,18.87 2.39,19.98 4.56,19.98
  vias: v1(13.14,19.16) v1(13.14,18.35) v1(13.14,17.54) v1(18.32,13.1) v1(18.32,12.08) v1(18.32,11.07) v1(18.32,10.05) v1(18.32,9.04) v1(19.35,13.1) v1(19.35,12.08) v1(19.35,11.07) v1(19.35,10.05) v1(19.35,9.04) v1(20.38,13.1) v1(20.38,12.08) v1(20.38,11.07) v1(20.38,10.05) v1(20.38,9.04) v1(21.41,13.1) v1(21.41,12.08) v1(21.41,11.07) v1(21.41,10.05) v1(21.41,9.04) v1(22.43,13.1) v1(22.43,12.08) v1(22.43,11.07) v1(22.43,10.05) v1(22.43,9.04)
MOTO-R1: length 86.9
  Top Layer w0.254: 86.45,8.09 78.93,8.09 78.84,8.18 78.75,8.27 78.75,14.01 78.93,14.19 83.99,14.19 85.29,12.89 91.07,12.89 91.68,12.28 91.68,8.78 91,8.09 86.45,8.09 ; 86.45,8.09 P2.1 ; U4.15 59.88,5.32 62.19,3.01 C10.2
  Top Layer w1.016: v2(68.34,3.82) 71.31,6.79 77.45,6.79 81.6,10.94 Q7.4 81.6,20.45 81,21.04 76.8,21.04 76.16,20.41 76.16,18.34 Q5.3
  Bottom Layer w1.016: v2(68.34,3.82) 63,3.82 v2(62.19,3.01)
  vias: v1(79.57,13.42) v1(79.57,12.41) v1(79.57,11.39) v1(79.57,10.38) v1(79.57,9.36) v1(80.59,13.42) v1(80.59,12.41) v1(80.59,11.39) v1(80.59,10.38) v1(80.59,9.36) v1(81.62,13.42) v1(81.62,12.41) v1(81.62,11.39) v1(81.62,10.38) v1(81.62,9.36) v1(82.65,13.42) v1(82.65,12.41) v1(82.65,11.39) v1(82.65,10.38) v1(82.65,9.36) v1(83.68,13.42) v1(83.68,12.41) v1(83.68,11.39) v1(83.68,10.38) v1(83.68,9.36)
MOTO-R2: length 122.5
  Top Layer w0.305: 88.81,20.31 83.61,20.31 83.04,19.74 83.04,17.69 86.22,14.52 91.05,14.52 91.68,15.15 91.68,19.67 91.05,20.31 88.81,20.31 ; 88.81,20.31 89.53,19.58 P2.2
  Top Layer w0.508: U4.11 58.24,10.42 57,10.42 C15.2 v1(55.07,11.4)
  Bottom Layer w0.305: 91.68,18.32 91.68,19.67 91.05,20.31 72.5,20.31 71.11,18.91 71.11,9.13 ; 91.68,18.32 91.68,15.15 91.05,14.52 86.22,14.52 83.28,17.46 77.08,17.46 76.57,16.95 76.57,9 75.91,8.34 71.49,8.34 71.11,8.72 71.11,9.13 ; 91.68,18.32 P2.2 ; 71.11,9.13 70.7,8.72
  Bottom Layer w0.508: 71.11,8.72 64.5,8.72 60.64,12.59 57.87,12.59 56.68,11.4 v1(55.07,11.4)
  vias: v1(71.78,13.18) v1(71.78,12.16) v1(71.78,11.14) v1(71.78,10.13) v1(71.78,9.11) v1(72.81,13.18) v1(72.81,12.16) v1(72.81,11.14) v1(72.81,10.13) v1(72.81,9.11) v1(73.83,13.18) v1(73.83,12.16) v1(73.83,11.14) v1(73.83,10.13) v1(73.83,9.11) v1(74.86,13.18) v1(74.86,12.16) v1(74.86,11.14) v1(74.86,10.13) v1(74.86,9.11) v1(75.89,13.18) v1(75.89,12.16) v1(75.89,11.14) v1(75.89,10.13) v1(75.89,9.11) v1(86.17,19.82) v1(86.17,18.81) v1(86.17,17.79) v1(87.2,19.82) v1(87.2,18.81) v1(87.2,17.79) v1(88.23,19.82) v1(88.23,18.81) v1(88.23,17.79)
NETC6_1: length 5.3
  Top Layer w0.508: 34.55,4.05 34.56,4.04 34.56,1.95 C6.1 34.59,1.92 37.71,1.92 37.73,1.9
NETC9_1: length 6.2
  Top Layer w0.508: 28.43,15.42 D2.1 28.42,14.51 29.08,13.85 U1.9 29.06,12.92 25.65,12.92 C9.1
NETC10_1: length 5
  Top Layer w0.508: 63.73,4.05 63.74,4.05 63.74,1.9 C10.1 63.76,1.91 66.54,1.91 D4.1
NETC15_1: length 8.3
  Top Layer w0.508: 63.56,14.71 D5.1 62.12,14.72 60.34,12.94 U4.9 58.25,12.95 56.03,12.95 C15.1 56.01,12.96
NETD3_2: length 19.5
  Top Layer w0.254: U3.1 61.56,21.07 61.96,21.07 62.39,21.5 62.39,24.93 59.98,27.34 58.05,27.34 57.87,27.17 57.77,27.06 57.77,21.86 58.43,21.2 D3.2
  Top Layer w0.508: U3.1 61.42,21.2 59.6,21.2 D3.2
NETLED1_1: length 1.9
  Top Layer w0.305: LED1.1 31.66,37.06 31.66,35.23 R1.2
NETLED2_1: length 2.4
  Top Layer w0.305: R2.2 36.32,35.91 36.13,36.11 35.75,36.11 35.57,36.28 LED2.1
NETQ1_1: length 2.8
  Top Layer w0.762: R3.2 Q1.1
NETQ2_1: length 2.8
  Top Layer w0.508: R4.1 9.83,15.46 9.83,18.24 Q2.1
NETQ3_1: length 2.4
  Top Layer w0.508: Q3.1 9.85,4.06 9.85,1.69 R5.2
NETQ4_1: length 2.4
  Top Layer w0.508: Q4.1 18.11,4.06 18.11,1.7 R6.1
NETQ5_1: length 2.9
  Top Layer w0.508: R13.2 72,15.56 72,16.31 71.59,16.73 71.59,18.29 Q5.1
NETQ6_1: length 2.8
  Top Layer w0.508: R14.1 79.31,15.56 79.31,18.31 Q6.1
NETQ7_1: length 2.5
  Top Layer w0.508: R16.2 79.31,1.64 79.31,4.14 Q7.1
NETQ8_1: length 2.5
  Top Layer w0.508: Q8.1 71.57,4.13 71.57,1.65 71.58,1.64
NETR3_1: length 23
  Top Layer w0.508: 29.08,4.05 26.72,4.05 24.61,6.16 v1(16.95,6.16) ; v1(15.94,8.44) 15.94,12.36 16.57,12.99 R3.1
  Bottom Layer w0.508: v1(16.95,6.16) 15.94,7.17 v1(15.94,8.44)
NETR4_2: length 30.4
  Top Layer w0.508: v1(26.58,14.52) 26.58,19.46 24.98,21.06 12.82,21.06 11.38,19.63 R4.2 ; v1(27.5,11.67) 29.08,11.67
  Bottom Layer w0.508: v1(27.5,11.67) 26.58,12.58 v1(26.58,14.52)
NETR5_1: length 22.6
  Top Layer w0.508: U1.14 25.69,6.59 25.21,7.07 12.44,7.07 11.41,6.04 R5.1
NETR6_2: length 13.9
  Top Layer w0.508: R6.2 v1(19.66,4.88) ; v1(26.63,7.86) U1.13
  Bottom Layer w0.508: v1(19.66,4.88) 19.66,4.9 20.91,6.16 24.93,6.16 v1(26.63,7.86)
NETR7_2: length 5
  Top Layer w0.305: 39.12,8.26 R7.2 ; U1.5 34.56,9.12
  Top Layer w0.508: 39.12,8.26 37.31,8.26 36.44,9.13 U1.5
NETR12_1: length 3.8
  Top Layer w0.508: U3.3 61.41,19.29 59.51,19.29 R19.2 ; R19.2 59.49,19.27 57.74,19.27 R12.1 57.76,19.25 ; R19.2 59.52,19.26
NETR13_1: length 21.4
  Top Layer w0.305: 70.46,15.56 70.45,15.55 70.45,7.91 v1(67.93,5.4) ; 58.26,4.05 v1(59.63,4.05)
  Bottom Layer w0.305: v1(67.93,5.4) 62.61,5.4 61.27,4.05 v1(59.63,4.05)
NETR14_2: length 28.8
  Top Layer w0.508: 77.67,15.48 R14.2 v1(77.75,14.55) ; 58.26,11.67 v1(59.91,11.67)
  Bottom Layer w0.508: v1(77.75,14.55) 77.75,8.52 76.75,7.53 64.05,7.53 v1(59.91,11.67)
NETR16_1: length 27.9
  Top Layer w0.305: v1(74.92,1.64) R16.1 ; U4.14 58.22,6.55 56.82,6.55 56.55,6.29 56.55,2.48 v1(57.37,1.66)
  Bottom Layer w0.305: v1(74.92,1.64) 74,0.72 58.31,0.72 v1(57.37,1.66)
NETR17_2: length 23
  Top Layer w0.305: R17.2 68.85,1.64 67.93,0.72 56.5,0.72 55.99,1.23 55.99,7.06 56.79,7.86 U4.13
NETR21_2: length 3.9
  Top Layer w0.508: U4.5 63.74,9.14 67.67,9.14 R21.2
PWM-L1: length 23.1
  Top Layer w0.254: U2.2 40.63,22.24 R8.2
  Top Layer w0.305: R8.2 39.38,22.25 38.49,23.13 38.49,31.36 40.47,33.34 46.09,33.34 46.39,33.03 P4.1
PWM-L1A: length 22.2
  Top Layer w0.305: v1(39.08,15.91) 39.08,20.94 39.41,21.27 41.51,21.27 41.83,21.59 U2.3
  Top Layer w0.508: v1(38.43,7.09) 37.09,7.09 36.59,6.59 U1.3
  Bottom Layer w0.305: v1(38.43,7.09) 39.08,7.73 v1(39.08,15.91)
PWM-L2: length 15.9
  Top Layer w0.254: R9.2 40.65,20.29 U2.5
  Bottom Layer w0.254: P4.5 38.52,28.87 38.52,23.1 v1(41.34,20.28)
PWM-L2A: length 18.1
  Top Layer w0.305: U2.6 41.92,19.64 41.69,19.42 41.69,15.7 40.01,14.01 v1(37.38,14.01)
  Top Layer w0.508: U1.4 v1(35.98,7.86)
  Bottom Layer w0.305: v1(35.98,7.86) 36.72,8.6 36.72,13.35 v1(37.38,14.01)
PWM-R1: length 15.1
  Top Layer w0.305: U2.9 52.13,19.64 R11.1
  Bottom Layer w0.305: v1(51.29,19.62) 46.39,24.52 P4.2
PWM-R1A: length 33.4
  Top Layer w0.305: v1(50.74,18.4) 50.15,18.99 U2.8 ; v1(69.41,11.26) 69.41,8.16 67.83,6.59 U4.3
  Bottom Layer w0.305: v1(69.41,11.26) 65.87,14.8 56.66,14.8 53.06,18.4 v1(50.74,18.4)
PWM-R2: length 16.7
  Top Layer w0.305: P4.6 41.31,27.17 42.07,26.4 45.22,26.4 46.09,25.54 46.09,22.8 47.29,21.59 U2.12 52.15,21.59 R10.1
PWM-R2A: length 33.9
  Top Layer w0.305: U4.4 63.76,7.84 67.93,7.84 68.69,8.6 v1(68.69,14.49) ; U2.11 50.66,20.94 50.99,20.61 v1(53.1,20.61)
  Bottom Layer w0.305: v1(68.69,14.49) 67,16.18 57.53,16.18 v1(53.1,20.61)

## Copper pours and planes (outline as drawn; the poured copper is in the pictures)
5V on Top Layer: 33.57,35.76 68.26,35.76 68.26,18.99 33.57,18.99
12V on Top Layer: 55.38,21.96 56.53,21.96 56.53,16.95 55.38,16.95
12V on Top Layer: 54.57,21.96 56.53,21.96 56.53,17.08 54.57,17.08
GND on Top Layer: 3,0 0.88,0.88 0,3 0,35.3 0.88,37.42 3,38.3 89.84,38.3 91.96,37.42 92.84,35.3 92.84,3.13 91.98,0.94 89.84,0
GND on Bottom Layer: 3,0 0.88,0.88 0,3 0,35.3 0.88,37.42 3,38.3 89.84,38.3 91.96,37.42 92.84,35.3 92.84,3.13 91.98,0.94 89.84,0
VCC on Top Layer: 8.85,36.18 32.3,36.18 32.3,22.22 8.85,22.22
VCC on Bottom Layer: 17.64,28.31 23.28,28.31 23.28,22.22 17.64,22.22
VCC on Bottom Layer: 9.35,28.31 14.99,28.31 14.99,22.21 9.35,22.21
VCC on Bottom Layer: 25.34,37.73 84.97,37.73 84.97,22.66 25.34,22.66
MOTO-L1 on Top Layer: 2.03,14.11 15.01,14.11 15.01,8.22 2.03,8.22
MOTO-L1 on Bottom Layer: 9.36,14.13 15,14.13 15,8.04 9.36,8.04
MOTO-L2 on Top Layer: 12.48,19.7 14.9,19.7 14.9,16.9 12.48,16.9
MOTO-L2 on Bottom Layer: 1.28,19.98 22.79,19.98 22.79,8.4 1.28,8.4
MOTO-R1 on Top Layer: 78.75,14.19 91.68,14.19 91.68,8.09 78.75,8.09
MOTO-R1 on Bottom Layer: 78.75,14.15 84.39,14.15 84.39,8.05 78.75,8.05
MOTO-R2 on Top Layer: 83.04,20.31 91.68,20.31 91.68,14.52 83.04,14.52
MOTO-R2 on Bottom Layer: 71.11,20.31 91.68,20.31 91.68,8.34 71.11,8.34
NETD3_2 on Top Layer: 57.77,27.34 62.39,27.34 62.39,21.07 57.77,21.07

Small or netless copper shapes (teardrops, artwork), in the pictures only: 226 on Top Layer, 34 on Bottom Layer
